# Altium project cs301_3.PrjPCB
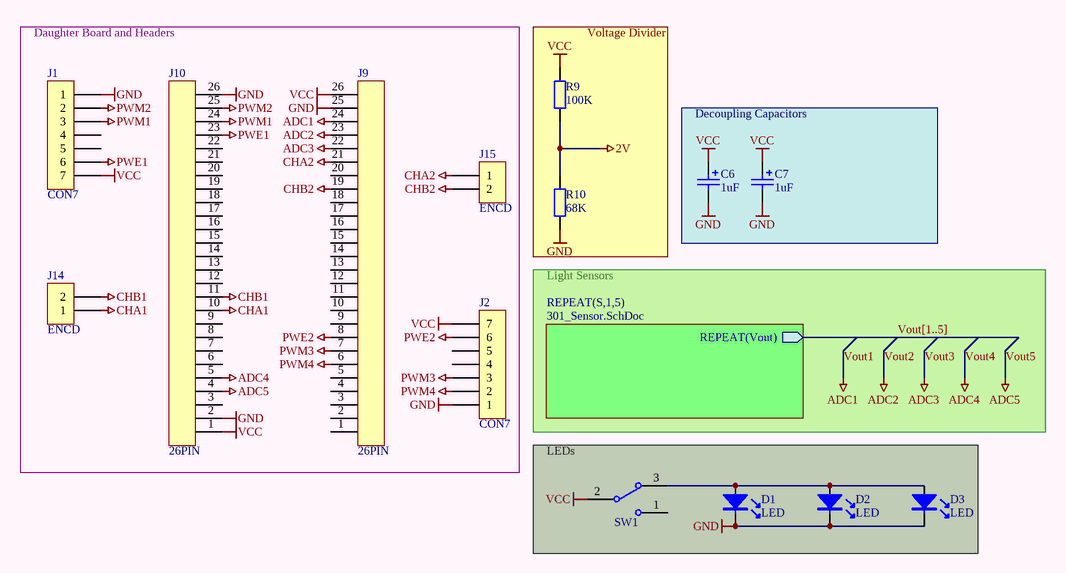
[diagram p0: cs301_3.SchDoc]
2 sheets, 104 parts. Net scope: hierarchical (ports join the sheet entries above them; power ports are global).
Board file: cs301_3.PcbDoc
Sheets:
  cs301_3.SchDoc
    S1 = 301_Sensor.SchDoc
    S2 = 301_Sensor.SchDoc
    S3 = 301_Sensor.SchDoc
    S4 = 301_Sensor.SchDoc
    S5 = 301_Sensor.SchDoc

## Sheet cs301_3.SchDoc
size A4

### Parts
C6  1uF  [ece-RAD-CAP--5X6.8]
C7  1uF  [ece-RAD-CAP--5X6.8]
D1  LED  [LED0.1/5MM]
D2  LED  [LED0.1/5MM]
D3  LED  [LED0.1/5MM]
J1  CON7  [SIP7]
J2  CON7  [SIP7]
J9  26PIN  [SIP26]
J10  26PIN  [SIP26]
J14  ENCD  [sip2]
J15  ENCD  [sip2]
R9  100K  [RESC2012-0805SM]
R10  68K  [RESC2012-0805SM]
SW1  SW  [ece-sw-SPDT]  (value not drawn)

### Blocks framed on the sheet
Daughter Board and Headers: J1 J2 J9 J10 J14 J15
Voltage Divider: R9 R10
Decoupling Capacitors: C6 C7
LEDs: D1-D3 SW1

### Sub-sheets
REPEAT(S,1,5) = 301_Sensor.SchDoc: REPEAT(Vout) (out)

### Nets
2V: R9.1 R10.2
CHA1: J10.10 J14.1
CHA2: J9.21 J15.1
CHB1: J10.11 J14.2
CHB2: J9.19 J15.2
GND: C6.2 C7.2 D1.K D2.K D3.K J1.1 J2.1 J9.25 J10.2 J10.26 R10.1
PWE1: J1.6 J10.23
PWE2: J2.6 J9.8
PWM1: J1.3 J10.24
PWM2: J1.2 J10.25
PWM3: J2.3 J9.7
PWM4: J2.2 J9.6
VCC: C6.1 C7.1 J1.7 J2.7 J9.26 J10.1 R9.2 SW1.2
Vout1: J9.24  [also labelled ADC1]
Vout2: J9.23  [also labelled ADC2]
Vout3: J9.22  [also labelled ADC3]
Vout4: J10.5  [also labelled ADC4]
Vout5: J10.4  [also labelled ADC5]
NetD1_A: D1.A D2.A D3.A SW1.3

Not connected (* = marked no-connect by the designer): J1 4 5; J2 4 5; J9 1 2 3 4 5 9 10 11 12 13 14 15 16 17 18 20; J10 3 6 7 8 9 12 13 14 15 16 17 18 19 20 21 22; SW1 1

### Buses and harness runs
bus Vout[1..5]

### Notes on the sheet
- Light Sensors

### Library data of the parts
C6 C7 = CAP 1-10uF TH: Polarized Capacitor (Radial); Manufacturer: Generic Components; Class I: Passive; Published: 8-Jun-2000; Revision: July-2002: Re-released for DXP Platform.; Publisher: Altium Limited; Class II: Capacitor; Value: 1uF
J1 J2 = CON7: Connector
J14 J15 = CON2: Connector
R9 R10 = Res SM 0805: SM resistor
  R9: Value: 100K
  R10: Value: 68K
SW1 = switch-SPDT: PCB mountabel switch

## Sheet 301_Sensor.SchDoc
size A4
Used 5 times, as channels S1, S2, S3, S4, S5. Parts and nets are listed once, with the designators drawn on the sheet.
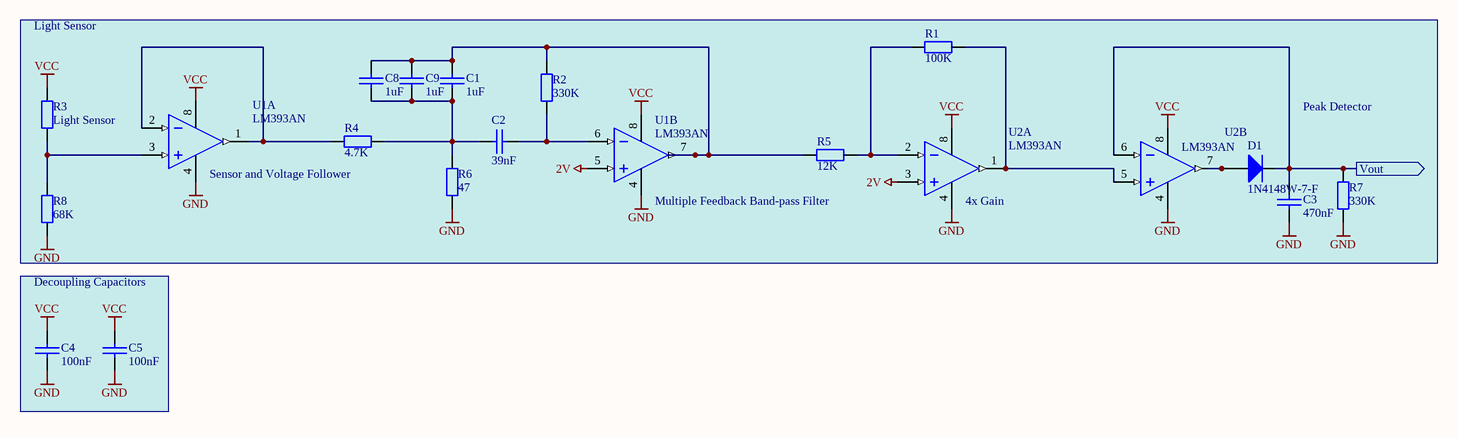
[diagram p1: 301_Sensor.SchDoc]

### Parts
C1  1uF  [ece-CC2012-0805]
C2  39nF  [ece-CC2012-0805]
C3  470nF  [ece-CC2012-0805]
C4  100nF  [ece-RAD0.2]
C5  100nF  [ece-RAD0.2]
C8  1uF  [ece-CC2012-0805]
C9  1uF  [ece-CC2012-0805]
D1  1N4148W-7-F  [SOD123]
R1  100K  [RESC2012-0805SM]
R2  330K  [RESC2012-0805SM]
R3  Light Sensor  [RESC2012-0805SM]
R4  4.7K  [RESC2012-0805SM]
R5  12K  [RESC2012-0805SM]
R6  47  [RESC2012-0805SM]
R7  330K  [RESC2012-0805SM]
R8  68K  [RESC2012-0805SM]
U1  LM393AN  [ECE-DIP8]  (parts A,B of 2)
U2  LM393AN  [ECE-DIP8]  (parts A,B of 2)

### Blocks framed on the sheet
Decoupling Capacitors: C4 C5

### Ports
Vout (out)

### Nets
2V: U1.5(IN+) U2.3(IN+)
GND: C3.2 C4.2 C5.2 R6.1 R7.1 R8.1 U1.4(GND) U2.4(GND)
VCC: C4.1 C5.1 R3.2 U1.8(V+) U2.8(V+)
Vout: C3.1 D1.2(K) R7.2 U2.6(IN-) ; port Vout
NetC1_1: C1.1 C8.1 C9.1 R2.2 R5.2 U1.7(OUT)
NetC1_2: C1.2 C2.1 C8.2 C9.2 R4.2 R6.2
NetC2_2: C2.2 R2.1 U1.6(IN-)
NetD1_1: D1.1(A) U2.7(OUT)
NetR1_1: R1.1 R5.1 U2.2(IN-)
NetR1_2: R1.2 U2.1(OUT) U2.5(IN+)
NetR3_1: R3.1 R8.2 U1.3(IN+)
NetR4_1: R4.1 U1.1(OUT) U1.2(IN-)

### Channels
S1: designators end in _S1; ports Vout=NetC3_S1_1
S2: designators end in _S2; ports Vout=NetC3_S2_1
S3: designators end in _S3; ports Vout=NetC3_S3_1
S4: designators end in _S4; ports Vout=NetC3_S4_1
S5: designators end in _S5; ports Vout=NetC3_S5_1

### Notes on the sheet
- Light Sensor
- Peak Detector
- (near U1) Sensor and Voltage Follower
- Multiple Feedback Band-pass Filter
- (near U2) 4x Gain

### Library data of the parts
C1-C3 C8 C9 = CAP SM0805: SM capacitor
  C1 C8 C9: Value: 1uF
  C2: Value: 39nF
  C3: Value: 470nF
C4 C5 = CAP: Capacitor Non Polarised Through Hole; Value: 100nF
D1 = SMT-Diode 1N4148W-7-F: DIODE GEN PURP 100V 300MA SOD123; Manufacturer: Diodes Incorporated; Manufacturer Part Number: 1N4148W-13-F; Diode Type: Standard; Current - Average Rectified (Io): 150mA; Speed: Small Signal =< 200mA (Io), Any Speed; Capacitance @ Vr, F: 2pF @ 0V, 1MHz; Supplier 1: Digi-Key; RoHS: RoHS Compliant; Category: Discrete Semiconductor Products; Stock 1: 5282; Pricing 1: 1=0.33, 10=0.292, 100=0.1586, 500=0.0976, 1000=0.06656 (NZD); Packaging: Cut Tape (CT); Part Status: Active; Mounting Type: Surface Mount; Package / Case: SOD-123; Supplier Device Package: SOD-123; Operating Temperature - Junction: -65°C ~ 150°C; Base Part Number: 1N4148W; ComponentLink1URL: https://www.diodes.com/assets/Datasheets/ds30086.pdf; ComponentLink1Description: https://www.diodes.com/assets/Datasheets/ds30086.pdf; Supplier Part Number 1: 1N4148W-13FDICT-ND
R1-R8 = Res SM 0805: SM resistor
  R1: Value: 100K
  R2 R7: Value: 330K
  R3: Value: Light Sensor
  R4: Value: 4.7K
  R5: Value: 12K
  R6: Value: 47
  R8: Value: 68K
U1 U2 = LM393AN: Dual Comparator; Published: 17-Jul-2002; LatestRevisionDate: 06-Jun-2005; LatestRevisionNote: Stylized 3D Model Added.; DatasheetVersion: 1988; PackageReference: 626-05; Publisher: Altium Limited; PackageDescription: DIP; 8 Leads; Row Spacing 7.62 mm; Pitch 2.54 mm; ComponentLink1Description: Manufacturer Link; ComponentLink1URL: http://www.onsemi.com/site/products/taxonomy/0,4438,133,00.html

## Nets that join several sheets
2V: cs301_3 (R9.1 R10.2), S1 (U1_S1.5 U2_S1.3), S2 (U1_S2.5 U2_S2.3), S3 (U1_S3.5 U2_S3.3), S4 (U1_S4.5 U2_S4.3), S5 (U1_S5.5 U2_S5.3)
GND: cs301_3 (11 pins), S1 (8 pins), S2 (8 pins), S3 (8 pins), S4 (8 pins), S5 (8 pins)
VCC: cs301_3 (8 pins), S1 (5 pins), S2 (5 pins), S3 (5 pins), S4 (5 pins), S5 (5 pins)